# Altium schematic sheet flash.SchDoc: Copper Suicide - Flash
size Letter; CheckedBy: E. Chiu; CompanyName: Signal Laboratories, Inc.; DrawnBy: J. Brinton; Engineer: J. Brinton; Address1: 3479 Edison Way; Address2: Menlo Park CA 94025; Address3: +1 (877) 778-8435; Address4: siglabs.com; Revision: 1; SheetNumber: 23; SheetTotal: 44
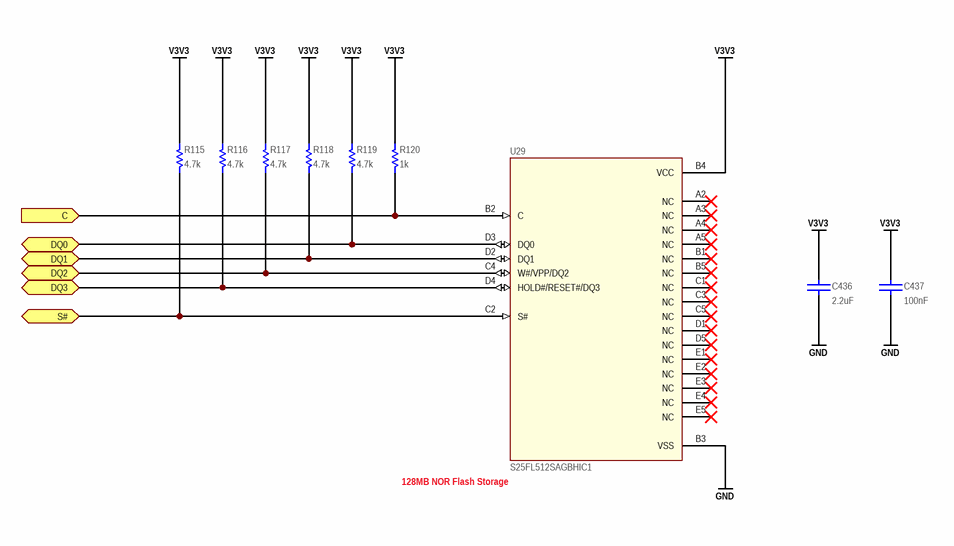
[diagram p0: flash.SchDoc]

## Parts
C436  value 2.2uF  [CAPC160X80X90L20N]  (hidden comment: C1608X7R1A225M080)
C437  value 100nF  [CAPC100X50X55L25N]  (hidden comment: GCM155R71H104KE02)
R115  value 4.7k  [RESC1005X40N]  (hidden comment: ERJ-2RKF4701X)
R116  value 4.7k  [RESC1005X40N]  (hidden comment: ERJ-2RKF4701X)
R117  value 4.7k  [RESC1005X40N]  (hidden comment: ERJ-2RKF4701X)
R118  value 4.7k  [RESC1005X40N]  (hidden comment: ERJ-2RKF4701X)
R119  value 4.7k  [RESC1005X40N]  (hidden comment: ERJ-2RKF4701X)
R120  value 1k  [RESC1005X40N]  (hidden comment: ERJ-2RKF1001X)
U29  S25FL512SAGBHIC1  [L-PBGA-24]

## Ports
C (in), DQ0 (bidir), DQ1 (bidir), DQ2 (bidir), DQ3 (bidir), S# (bidir)

## Nets
GND: C436.1 C437.1 U29.B3(VSS)
V3V3: C436.2 C437.2 R115.2 R116.2 R117.2 R118.2 R119.2 R120.2 U29.B4(VCC)
C: R120.1 U29.B2(C) ; port C
DQ0: R119.1 U29.D3(DQ0) ; port DQ0
DQ1: R118.1 U29.D2(DQ1) ; port DQ1
DQ2: R117.1 U29.C4(W#/VPP/DQ2) ; port DQ2
DQ3: R116.1 U29.D4(HOLD#/RESET#/DQ3) ; port DQ3
S#: R115.1 U29.C2(S#) ; port S#

Not connected (* = marked no-connect by the designer): U29 A2(NC)* A3(NC)* A4(NC)* A5(NC)* B1(NC)* B5(NC)* C1(NC)* C3(NC)* C5(NC)* D1(NC)* D5(NC)* E1(NC)* E2(NC)* E3(NC)* E4(NC)* E5(NC)*

## Notes on the sheet
- (near U29) 128MB NOR Flash Storage
- Title
- Engineer
- Revision
- Drawn By
- Checked By
- Date
- Sheet
- of

## Library data of the parts
C436 = CAP: Ceramic Capacitor 2.2uF ±20% 10V X7R 0603; Manufacturer: TDK; Tr: -55:125; Manufacturer P/N: C1608X7R1A225M080; Tolerance: ±20%; Voltage: 10V; Footprint: *; Package: 0603
C437 = CAP: Ceramic Capacitor 100nF ±10% 50V X7R 0402; Manufacturer: Murata; Tr: -55:125; Manufacturer P/N: GCM155R71H104KE02; Tolerance: ±10%; Voltage: 50V; Footprint: *; Package: 0402
R115-R119 = RES: Thick Film Resistor 4.7k ±1% 0.1W 75V 0402; Manufacturer: Panasonic; Tcr: ±100; Tr: -55:155; Voltage: 75; Power: 0.1; Tolerance: ±1%; Manufacturer P/N: ERJ-2RKF4701X; Alternatives: *; Footprint: *; Package: 0402
R120 = RES: Thick Film Resistor 1k ±1% 0.1W 50V 0402; Manufacturer: Panasonic; Tcr: ±100; Tr: -55:155; Voltage: 50; Power: 0.1; Tolerance: ±1%; Manufacturer P/N: ERJ-2RKF1001X; Alternatives: *; Footprint: *; Package: 0402
U29 = N25Q00AA13G1240: 1024Mb, 3.3V Serial Flash Memory LBGA24; Manufacturer: Cypress; Manufacturer P/N: S25FL512SAGBHIC1